# Altium schematic sheet tinee_timer.SchDoc
size A1
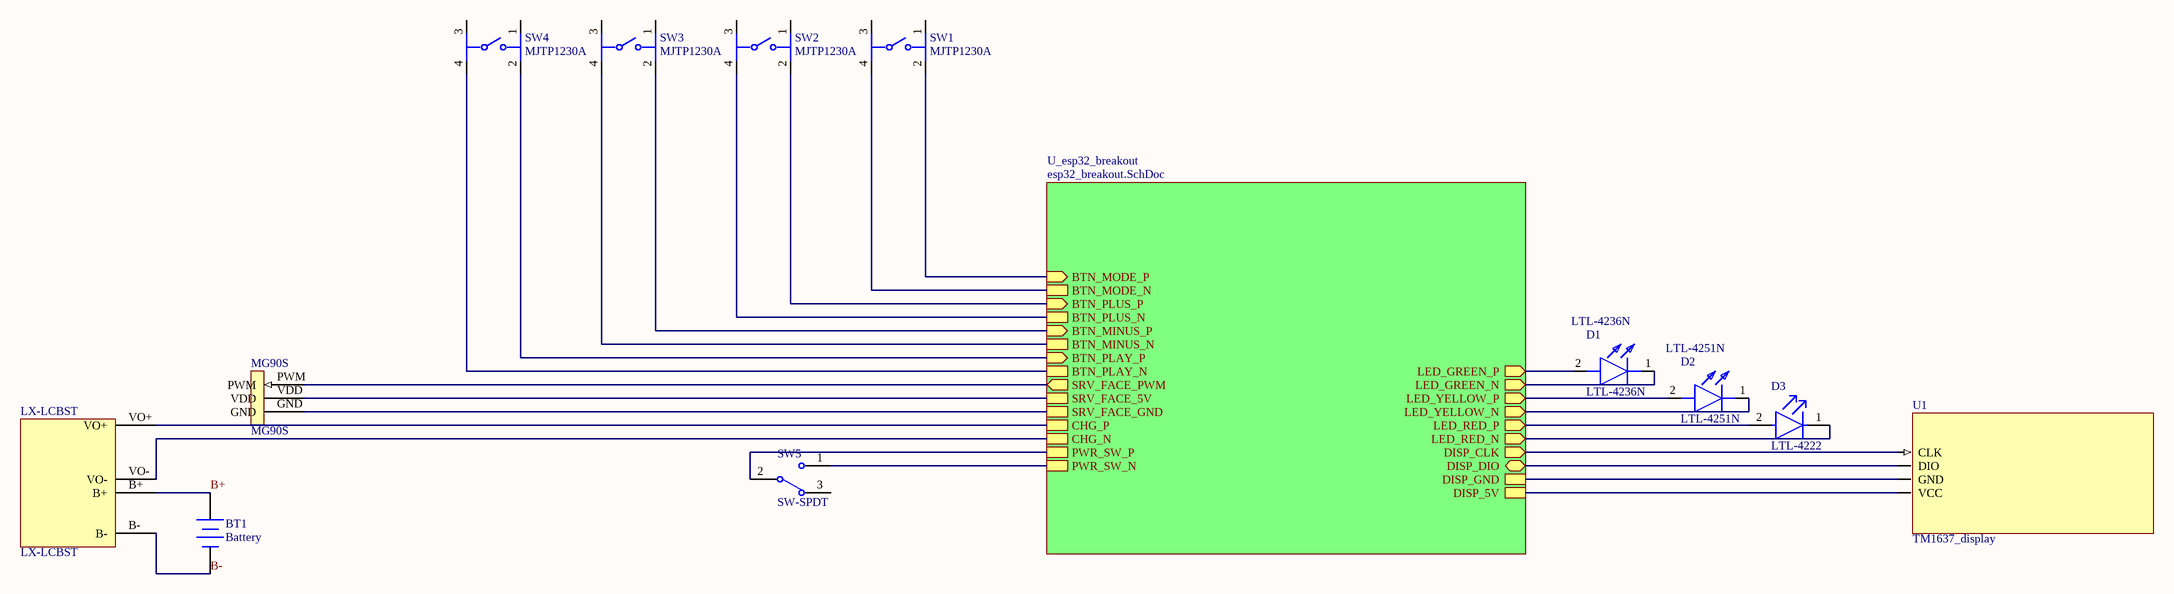
[diagram p0: tinee_timer.SchDoc]

## Parts
BT1  Battery  [BAT-2]
D1  LTL-4236N  [LTL4236N]
D2  LTL-4251N  [LTL4236N]
D3  LTL-4222  [FP-LTL-4222-MFG]
LX-LCBST  LX-LCBST
MG90S  MG90S
SW1  MJTP1230A  [FP-MJTP1230A-MFG]
SW2  MJTP1230A  [FP-MJTP1230A-MFG]
SW3  MJTP1230A  [FP-MJTP1230A-MFG]
SW4  MJTP1230A  [FP-MJTP1230A-MFG]
SW5  SW-SPDT  [TL36WW15050]
U1  TM1637_display

## Sub-sheets
U_esp32_breakout = esp32_breakout.SchDoc: LED_RED_N (out), LED_YELLOW_P (out), PWR_SW_P, DISP_CLK (out), LED_GREEN_N (out), CHG_P, BTN_PLAY_P (in), DISP_GND, LED_GREEN_P (out), SRV_FACE_GND, SRV_FACE_5V, BTN_PLAY_N, PWR_SW_N, LED_YELLOW_N (out), BTN_MODE_P (in), BTN_MODE_N, BTN_PLUS_N, DISP_5V, SRV_FACE_PWM (out), CHG_N, BTN_PLUS_P (in), DISP_DIO (bidir), LED_RED_P (out), BTN_MINUS_P (in), BTN_MINUS_N

## Nets
B+: BT1.1(+) LX-LCBST.B+
B-: BT1.2(-) LX-LCBST.B-
NetD1_1: D1.1(K) ; sheet U_esp32_breakout/LED_GREEN_N
NetD1_2: D1.2(A) ; sheet U_esp32_breakout/LED_GREEN_P
NetD2_1: D2.1(K) ; sheet U_esp32_breakout/LED_YELLOW_N
NetD2_2: D2.2(A) ; sheet U_esp32_breakout/LED_YELLOW_P
NetD3_1: D3.1(C) ; sheet U_esp32_breakout/LED_RED_N
NetD3_2: D3.2(A) ; sheet U_esp32_breakout/LED_RED_P
NetLX-LCBST_VO+: LX-LCBST.VO+ ; sheet U_esp32_breakout/CHG_P
NetLX-LCBST_VO-: LX-LCBST.VO- ; sheet U_esp32_breakout/CHG_N
NetMG90S_GND: MG90S.GND ; sheet U_esp32_breakout/SRV_FACE_GND
NetMG90S_PWM: MG90S.PWM ; sheet U_esp32_breakout/SRV_FACE_PWM
NetMG90S_VDD: MG90S.VDD ; sheet U_esp32_breakout/SRV_FACE_5V
NetSW1_2: SW1.2 ; sheet U_esp32_breakout/BTN_MODE_P
NetSW1_4: SW1.4 ; sheet U_esp32_breakout/BTN_MODE_N
NetSW2_2: SW2.2 ; sheet U_esp32_breakout/BTN_PLUS_P
NetSW2_4: SW2.4 ; sheet U_esp32_breakout/BTN_PLUS_N
NetSW3_2: SW3.2 ; sheet U_esp32_breakout/BTN_MINUS_P
NetSW3_4: SW3.4 ; sheet U_esp32_breakout/BTN_MINUS_N
NetSW4_2: SW4.2 ; sheet U_esp32_breakout/BTN_PLAY_P
NetSW4_4: SW4.4 ; sheet U_esp32_breakout/BTN_PLAY_N
NetSW5_1: SW5.1 ; sheet U_esp32_breakout/PWR_SW_N
NetSW5_2: SW5.2 ; sheet U_esp32_breakout/PWR_SW_P
NetU1_CLK: U1.CLK ; sheet U_esp32_breakout/DISP_CLK
NetU1_DIO: U1.DIO ; sheet U_esp32_breakout/DISP_DIO
NetU1_GND: U1.GND ; sheet U_esp32_breakout/DISP_GND
NetU1_VCC: U1.VCC ; sheet U_esp32_breakout/DISP_5V

Not connected (* = marked no-connect by the designer): SW1 1 3; SW2 1 3; SW3 1 3; SW4 1 3; SW5 3

## Library data of the parts
BT1 = Battery: Multicell Battery; Published: 24-Mar-1999; LatestRevisionDate: 17-Jul-2002; LatestRevisionNote: Re-released for DXP Platform.; PackageReference: BAT-2; Publisher: Altium Limited; PackageDescription: Battery; 2 Leads
D1 = LTL-4236N: LED Round Dome Transparent Colorless Green 569nm 45° 2.1V 10mA DIP TH 3mm × 3mm × 5.85mm; Manufacturer_Name: Lite-On; Manufacturer: Diodes Inc.; Forward Current: 30mA; Forward Voltage: 2.8V; Lens Style: Clear; Luminous Intensity: 40mcd; Max Power Dissipation: 100mW; Number of Circuits: 1; Peak Wavelength: 565nm; Reverse Voltage: 5V; Datasheet Link: https://media.digikey.com/pdf/Data%20Sheets/Lite-On%20PDFs/LTL-4236N.pdf; Height: 5.85mm; Manufacturer_Part_Number: LTL-4236N; Mouser Part Number: 859-LTL-4236N; Mouser Price/Stock: https://www.mouser.co.uk/ProductDetail/Lite-On/LTL-4236N?qs=%252BY%252Bm5kuB5aiB3WZbX23AGA%3D%3D; Arrow Part Number: LTL-4236N; Arrow Price/Stock: https://www.arrow.com/en/products/ltl-4236n/lite-on-technology; Manufacturer Part Number: LTL-4236N; RoHS: Compliant; Category: LEDs; Stock 1: 973; Pricing 1: 1000=0.109, 3000=0.106, 5000=0.105, 15000=0.102, 25000=0.0993 (USD); Case/Package: T; China RoHS: Compliant; Color: Green; Country of Origin: Thailand; Depth: 3.2mm; Diameter: 3mm; Dominant Wavelength: 569nm; Export Control Classification Number (ECCN) Code: EAR99; Harmonized Tariff Schedule (HTS) Code: 8541.40.20.00; Illumination Color: Green; Introduction Date: 1992-03-31; Lead Free: Lead Free; Length: 3.2mm; Lens Color: Colorless; Lens Transparency: Clear; Lifecycle Status: Production; LTB Date: 2021-02-06; LTD Date: 2021-05-31; Max Operating Temperature: 100°C; Min Operating Temperature: -55°C; Mount: Through Hole; Number of Elements: 1; Number of LEDs: 1; Number of Pins: 2; Number of Terminals: 2; Packaging: Bulk; Power Dissipation: 100mW; Radiation Hardening: No; REACH SVHC: Affected; Schedule B: 8541402000, 8541402000|8541402000|8541402000|8541402000|8541402000; Shape: Round; Terminal Pitch: 2.54mm; Test Current: 10mA; Viewing Angle: 45°; Wavelength: 565nm; Width: 3.2mm; ComponentLink1URL: https://datasheet.octopart.com:443/LTL-4236N-Lite-On-datasheet-180603754.pdf?src-supplier=IHS; ComponentLink1Description: https://datasheet.octopart.com:443/LTL-4236N-Lite-On-datasheet-180603754.pdf?src-supplier=IHS; ComponentLink2URL: https://datasheet.octopart.com:443/LTL-4236N-Lite-On-datasheet-93175.pdf?src-supplier=TME; ComponentLink2Description: https://datasheet.octopart.com:443/LTL-4236N-Lite-On-datasheet-93175.pdf?src-supplier=TME; Stock 2: 28604; Pricing 2: 1=0.19, 10=0.132, 50=0.132, 100=0.09, 1000=0.066, 10000=0.052 (USD); Supplier 1: Future Electronics; Supplier Part Number 1: LTL-4236N
D2 = LTL-4251N: LED; Manufacturer_Name: Lite-On; Datasheet Link: https://media.digikey.com/pdf/Data%20Sheets/Lite-On%20PDFs/LTL-4251N.pdf; Height: 5.85mm; Manufacturer_Part_Number: LTL-4251N; Mouser Part Number: 859-LTL-4251N; Mouser Price/Stock: https://www.mouser.co.uk/ProductDetail/Lite-On/LTL-4251N?qs=ooQFeFo13p6X9Ku12Ljjeg%3D%3D; Arrow Part Number: LTL-4251N; Arrow Price/Stock: https://www.arrow.com/en/products/ltl-4251n/lite-on-technology?region=europe; Supplier 1: Arrow Electronics; Supplier Part Number 1: LTL-4251N
D3 = CMP-22017-000043-1: LED RED CLEAR T-1 T/H; Number of Elements: 1; Reverse Voltage: 5V; Lens Style: Dome; Power Dissipation: 100mW; Viewing Angle: 20°; Dominant Wavelength: 623nm; Wavelength: 635nm; Test Current: 10mA; Luminous Intensity: 29mcd; Forward Current: 20mA; Forward Voltage: 2V; Height: 6.55mm; Color: Red; Illumination Color: Red; Series: -; Packaging: Bulk; Case/Package: T; Mount: Through Hole; Length: 4mm; RoHS Compliant: Yes; Min Operating Temperature: -55°C; Lens Transparency: Clear; Max Operating Temperature: 100°C; Number of Pins: 2; Package Quantity: 1000; Number of LEDs: 1; Depth: 4mm; Lens Color: Red; Radiation Hardening: No
SW1-SW4 = CMP-47024-000004-1: SWITCH TACTILE SPST-NO 0.05A 12V; Mechanical Life: 100000Cycles; Throw Configuration: SPST; Actuator Length: 1.4mm; Switch Travel: 0.25mm; Actuator Color: Black; Operating Force: 160gf; Contact Resistance: 100mR; Actuator Type: Standard; Switch Function: Off-Mom; Actuator Material: Thermoplastic; Illumination Type: Non-Illuminated; Current Rating: 50mA; Min Operating Temperature: -20°C; Series: MJTP; Electrical Life: 100000Cycles; Mount: Through Hole; Packaging: Bulk; Color: Black; Package Quantity: 2000; Voltage Rating (DC): 12V; REACH SVHC: No SVHC; Orientation: Straight; Termination: PC Pin; Contact Material: Bronze; RoHS Compliant: Yes; Max Voltage Rating (DC): 12V; Max Operating Temperature: 70°C; Contact Plating: Silver
SW5 = SW-SPDT: SPDT Subminiature Toggle Switch, Right Angle Mounting, Vertical Actuation; Published: 24-Mar-1999; LatestRevisionDate: 17-Dec-2003; LatestRevisionNote: Schematic revised, PCB Footprint replaced.; DatasheetVersion: 05-Dec-2000; PackageReference: TL36WW15050; Publisher: Altium Limited; PackageDescription: Switch; 4 Leads; ComponentLink1Description: Manufacturer Link; ComponentLink1URL: http://www.apem.com